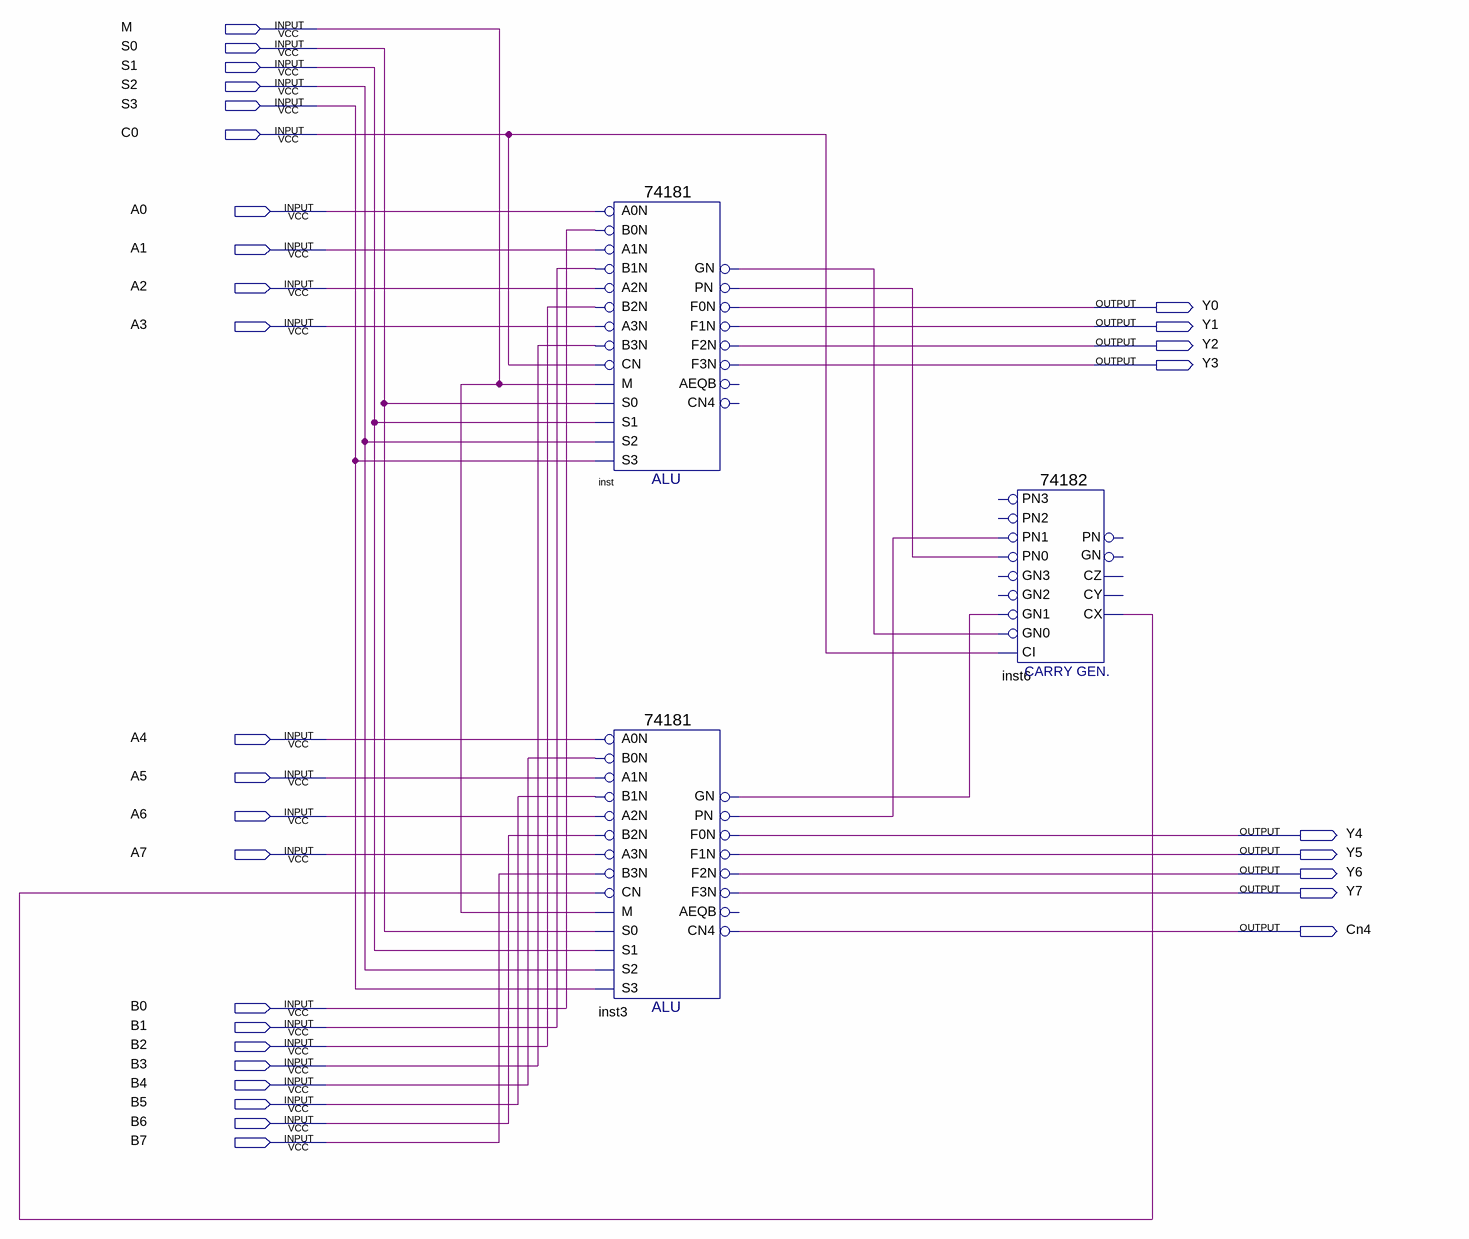
[diagram p0: schematic sheet]
// Quartus schematic ALU.bdf as structural Verilog: 3 symbols, 31 pins
module ALU (
  input  M,
  input  S0,
  input  S1,
  input  S2,
  input  S3,
  input  C0,
  input  A0,
  input  A1,
  input  A2,
  input  A3,
  input  A4,
  input  A5,
  input  A6,
  input  A7,
  input  B0,
  input  B1,
  input  B2,
  input  B3,
  input  B4,
  input  B5,
  input  B6,
  input  B7,
  output Y0,
  output Y1,
  output Y2,
  output Y3,
  output Y4,
  output Y5,
  output Y6,
  output Y7,
  output Cn4
);

  wire inst3_gn, inst3_pn, inst6_cx, inst_gn, inst_pn;

  \74181  inst (
    .B0N(B0), .A0N(A0), .A1N(A1), .B1N(B1), .A3N(A3), .B2N(B2), .A2N(A2), .M(M), .CN(C0), .B3N(B3), .S2(S2),
    .S1(S1), .S0(S0), .S3(S3), .PN(inst_pn), .GN(inst_gn), .F3N(Y3), .F1N(Y1), .F0N(Y0), .F2N(Y2));  // open: AEQB, CN4
  \74181  inst3 (
    .B0N(B4), .A0N(A4), .A1N(A5), .B1N(B5), .A3N(A7), .B2N(B6), .A2N(A6), .M(M), .CN(inst6_cx), .B3N(B7),
    .S2(S2), .S1(S1), .S0(S0), .S3(S3), .PN(inst3_pn), .GN(inst3_gn), .F3N(Y7), .F1N(Y5), .F0N(Y4),
    .CN4(Cn4), .F2N(Y6));  // open: AEQB
  \74182  inst6 (
    .CI(C0), .PN1(inst3_pn), .PN0(inst_pn), .GN1(inst3_gn), .GN0(inst_gn), .CX(inst6_cx));  // open: PN2, GN2, GN3, PN3, CY, PN, CZ, GN
endmodule
